# EAGLE schematic swarm_circuit (EAGLE 9.1.3)
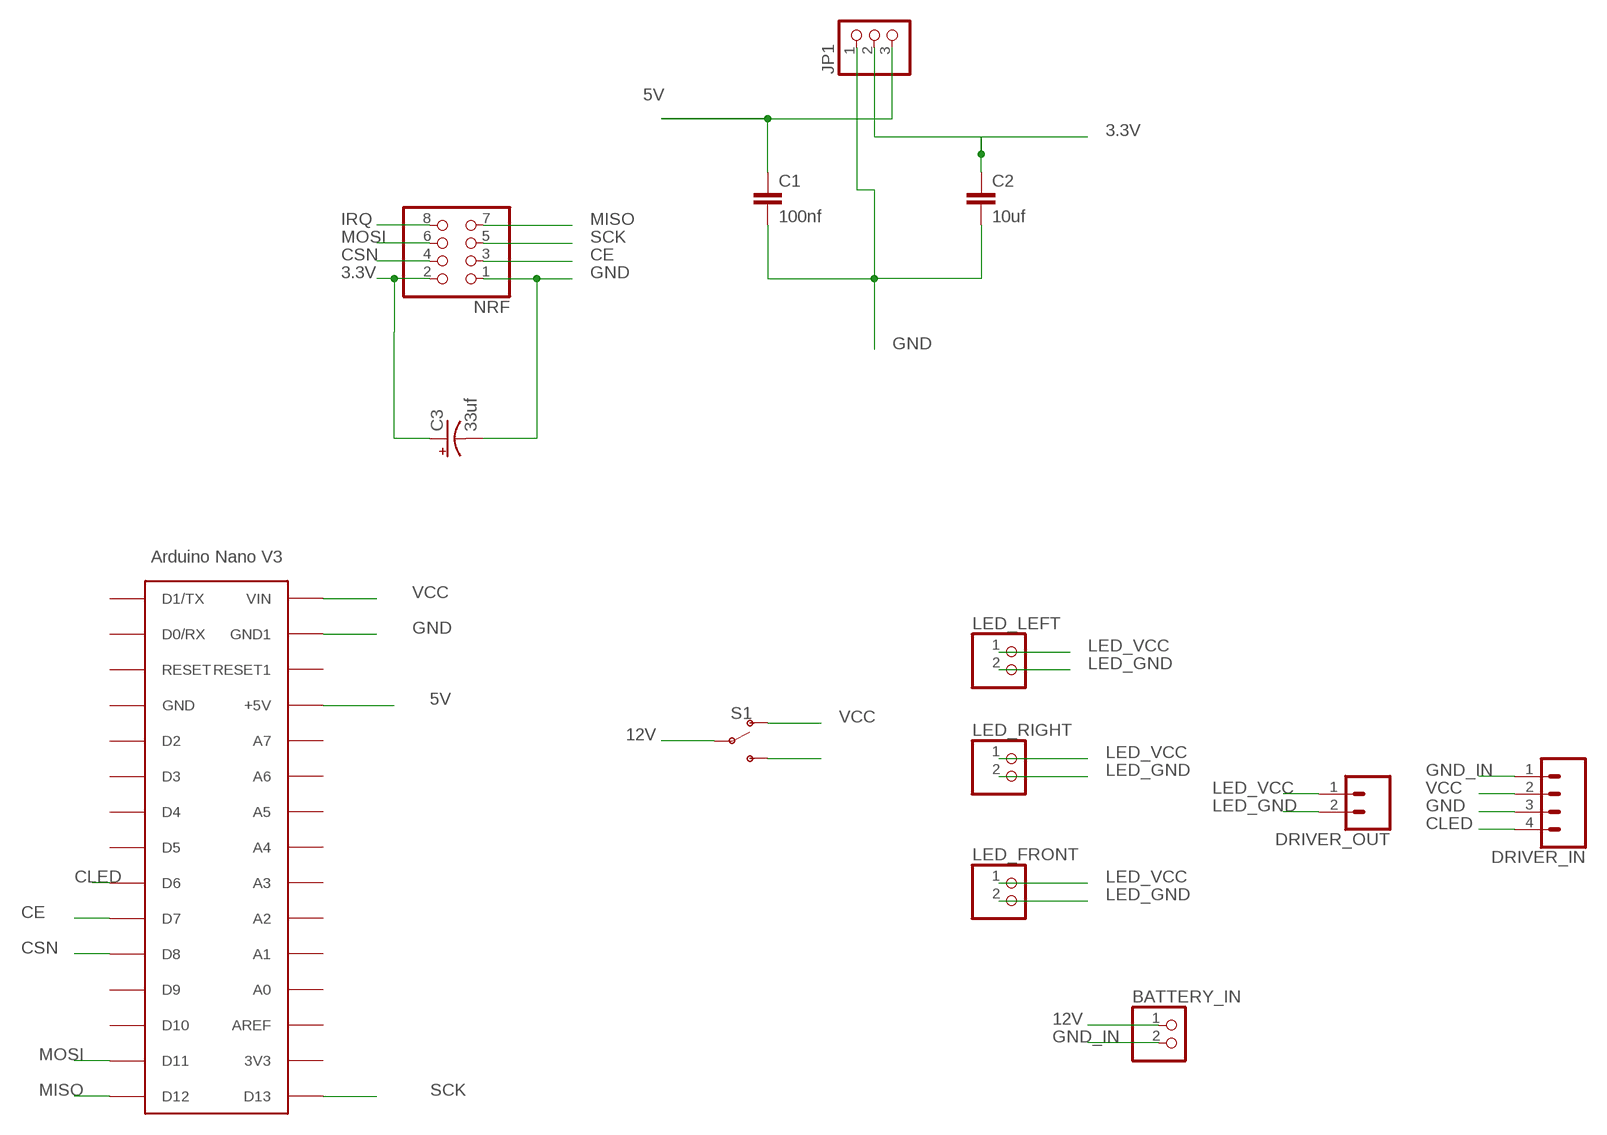
[diagram p0: schematic, sheet 1]

## Parts
BATTERY_IN  HEADER-1X2ROUND  [1X02_ROUND]
C1  100nf  0.1UF-KIT-EZ-50V-20%  [CAP-PTH-SMALL-KIT]
C2  10uf  0.1UF-KIT-EZ-50V-20%  [CAP-PTH-SMALL-KIT]
C3  33uf  1000UF-RADIAL-5MM-35V-20%-KIT  [CPOL-RADIAL-5MM-10MM-KIT]
DRIVER_IN  CONN_04  [1X04]
DRIVER_OUT  CONN_02  [1X02]
JP1  PINHD-1X3  [1X03]
LED_FRONT  HEADER-1X2ROUND  [1X02_ROUND]
LED_LEFT  HEADER-1X2ROUND  [1X02_ROUND]
LED_RIGHT  HEADER-1X2ROUND  [1X02_ROUND]
NRF  PINHD-2X4  [2X04]
S1  SWITCH-SPDT-PTH-11.6X4.0MM  [SWITCH_SPDT_PTH_11.6X4.0MM]
U$1  ARDUINONANO  [PDIP-32]

## Nets
3.3V: C2.1 C3.+ JP1.2 NRF.2
5V: C1.1 JP1.3 U$1.+5V
12V: BATTERY_IN.1 S1.2(P)
CE: NRF.3 U$1.D7
CLED: DRIVER_IN.4 U$1.D6
CSN: NRF.4 U$1.D8
GND: C1.2 C2.2 C3.- DRIVER_IN.3 JP1.1 NRF.1 U$1.GND1
GND_IN: BATTERY_IN.2 DRIVER_IN.1
IRQ: NRF.8
LED_GND: DRIVER_OUT.2 LED_FRONT.2 LED_LEFT.2 LED_RIGHT.2
LED_VCC: DRIVER_OUT.1 LED_FRONT.1 LED_LEFT.1 LED_RIGHT.1
MISO: NRF.7 U$1.D12
MOSI: NRF.6 U$1.D11
SCK: NRF.5 U$1.D13
VCC: DRIVER_IN.2 S1.1(O) S1.3(S) U$1.VIN
Unconnected: U$1.3V3 U$1.A0(A7) U$1.A1(A6) U$1.A2(A5) U$1.A3(A4) U$1.A4(A3) U$1.A5(A2) U$1.A6(A1) U$1.A7(A0) U$1.AREF U$1.D0/RX U$1.D1/TX U$1.D2 U$1.D3 U$1.D4 U$1.D5 U$1.D9 U$1.D10 U$1.GND U$1.RESET U$1.RESET1

## Library data of the parts
BATTERY_IN LED_FRONT LED_LEFT LED_RIGHT = microbuilder:HEADER-1X2: PIN HEADER
C1 C2 = SparkFun-Capacitors:0.1UF: 0.1µF ceramic capacitors A capacitor is a passive two-terminal electrical component used to store electrical energy temporarily in an electric field.; PROD_ID: CAP-08370; VALUE: 0.1uF
C3 = SparkFun-Capacitors:1000UF: 1,000µF/1mF ceramic capacitors A capacitor is a passive two-terminal electrical component used to store electrical energy temporarily in an electric field. CAP-08070; PROD_ID: CAP-09538; VALUE: 1mf
DRIVER_IN = SparkFun-Connectors:CONN_04: Multi connection point. Often used as Generic Header-pin footprint for 0.1 inch spaced/style header connections On any of the 0.1 inch spaced packages, you can populate with these: Break Away Headers - Straight <https://www.sparkfun.com/products/116> (PRT-00116) Break Away Male Headers - Right Angle <https://www.sparkfun.com/products/553> (PRT-00553) Female Headers <https://www.sparkfun.com/products/115> (PRT-00115) Break Away Headers - Machine Pin <https://www.sparkfun.com/products/117> (PRT-00117) Break Away Female Headers - Swiss Machine Pin <https://www.sparkfun.com/products/743> (PRT-00743) For SCREWTERMINALS and SPRING TERMINALS visit here: Screw Terimnals on SparkFun.com <https://www.sparkfun.com/search/results?term=Screw+Terminals> (5mm/3.5mm/2.54mm spacing) This device is also useful as a general connection point to wire up your design to another part of your project. Our various solder wires solder well into these plated through hole pads. Hook-Up Wire - Assortment (Stranded, 22 AWG) <https://www.sparkfun.com/products/11375> (PRT-11375) Hook-Up Wire - Assortment (Solid Core, 22 AWG) <https://www.sparkfun.com/products/11367> (PRT-11367) View the entire wire category on our website here <https://www.sparkfun.com/categories/141> Special notes: Molex polarized connector foot print use with SKU : PRT-08231 with associated crimp pins and housings. 1MM SMD Version SKU: PRT-10208; PROD_ID: CONN-09696
DRIVER_OUT = SparkFun-Connectors:CONN_02: Multi connection point. Often used as Generic Header-pin footprint for 0.1 inch spaced/style header connections On any of the 0.1 inch spaced packages, you can populate with these: Break Away Headers - Straight <https://www.sparkfun.com/products/116> (PRT-00116) Break Away Male Headers - Right Angle <https://www.sparkfun.com/products/553> (PRT-00553) Female Headers <https://www.sparkfun.com/products/115> (PRT-00115) Break Away Headers - Machine Pin <https://www.sparkfun.com/products/117> (PRT-00117) Break Away Female Headers - Swiss Machine Pin <https://www.sparkfun.com/products/743> (PRT-00743) For SCREWTERMINALS and SPRING TERMINALS visit here: Screw Terimnals on SparkFun.com <https://www.sparkfun.com/search/results?term=Screw+Terminals> (5mm/3.5mm/2.54mm spacing) This device is also useful as a general connection point to wire up your design to another part of your project. Our various solder wires solder well into these plated through hole pads. Hook-Up Wire - Assortment (Stranded, 22 AWG) <https://www.sparkfun.com/products/11375> (PRT-11375) Hook-Up Wire - Assortment (Solid Core, 22 AWG) <https://www.sparkfun.com/products/11367> (PRT-11367) View the entire wire category on our website here <https://www.sparkfun.com/categories/141> Special notes: Molex polarized connector foot print use with: PRT-08233 with associated crimp pins and housings. 2.54_SCREWTERM for use with PRT-10571. 3.5mm Screw Terminal footprints for PRT-08084 5mm Screw Terminal footprints for use with PRT-08432
JP1 = adafruit:PINHD-1X3: PIN HEADER
NRF = adafruit:PINHD-2X4: PIN HEADER
S1 = SparkFun-Switches:SWITCH-SPDT: Single Pole, Double Throw (SPDT) Switch Single-pole, double-throw (SPDT) switch. Variant Overview SMD-AYZ0202 Surface Mount DPDT Switch <https://www.sparkfun.com/products/597> (COM-00597) Used on e.g. LilyPad Arduino USB - ATmega32U4 Board <https://www.sparkfun.com/products/12049> PTH-11.6X4.0MM SPDT Mini Power Switch <https://www.sparkfun.com/products/102> (COM-00102) Used on e.g. SparkFun Simon Says - Through-Hole Soldering Kit <https://www.sparkfun.com/products/10547> (KIT-10547) PTH-11.6X4.0MM-KIT KIT version of SPDT Mini Power Switch - Simplifies soldering by removing tStop of switch pins - only one side can be soldered. PTH-11.6X4.0MM-LOCK LOCK version of SPDT Mini Power Switch - Offset pins hold switch in place for easier soldering. SMD-RIGHT-ANGLE Surface Mount Right Angle Switch <https://www.sparkfun.com/products/10860> (COM-10860) Used on e.g. SparkFun ESP8266 Thing <https://www.sparkfun.com/products/13231>; PROD_ID: SWCH-08261; SF_SKU: COM-00102
U$1 = CRE-Lib1:ARDUINONANO: Arduino Nano